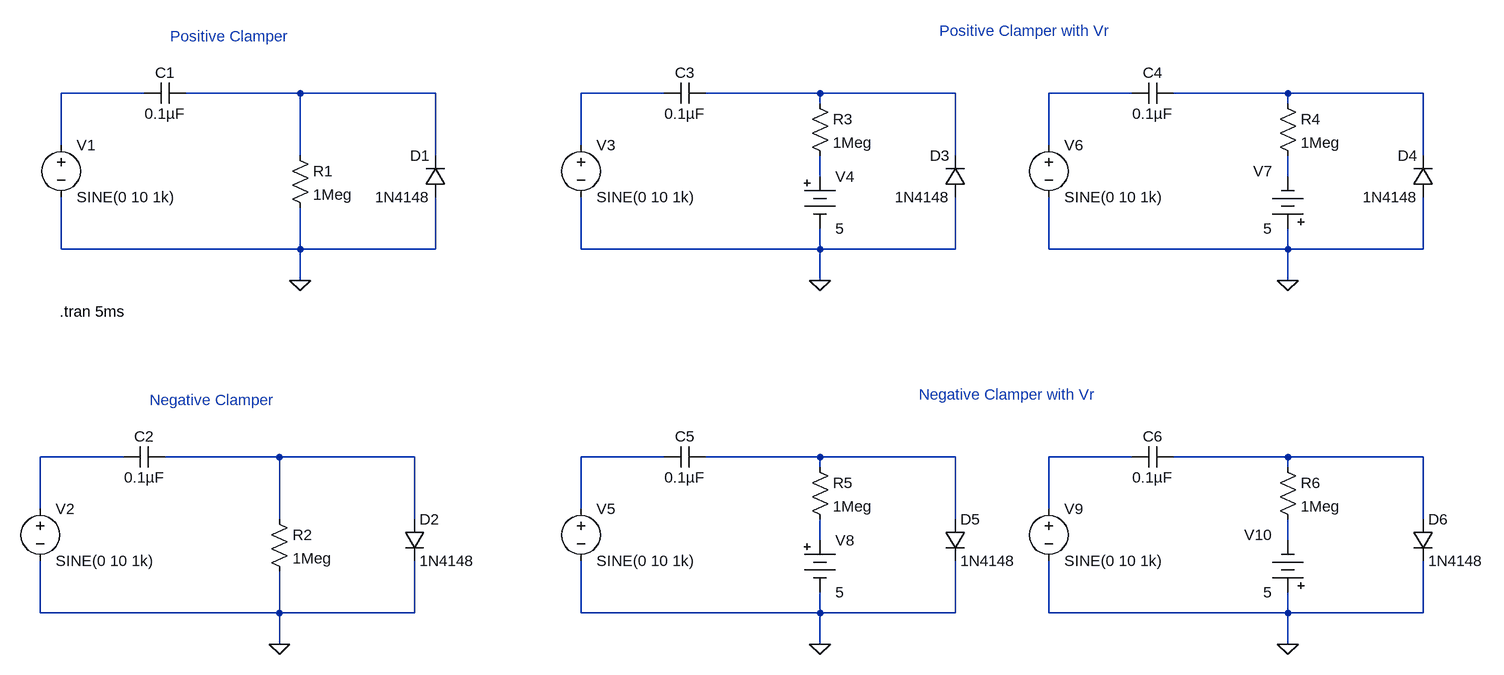
[diagram p0: schematic Diode Clampers.asc]
Diode Clampers.asc, the LTspice schematic file:
Version 4
SHEET 1 2264 952
WIRE 192 64 64 64
WIRE 432 64 256 64
WIRE 640 64 432 64
WIRE 992 64 864 64
WIRE 1232 64 1056 64
WIRE 1440 64 1232 64
WIRE 1712 64 1584 64
WIRE 1952 64 1776 64
WIRE 2160 64 1952 64
WIRE 1232 80 1232 64
WIRE 1952 80 1952 64
WIRE 64 144 64 64
WIRE 864 144 864 64
WIRE 1584 144 1584 64
WIRE 432 160 432 64
WIRE 640 160 640 64
WIRE 1440 160 1440 64
WIRE 2160 160 2160 64
WIRE 1232 192 1232 160
WIRE 1952 192 1952 160
WIRE 64 304 64 224
WIRE 432 304 432 240
WIRE 432 304 64 304
WIRE 640 304 640 224
WIRE 640 304 432 304
WIRE 864 304 864 224
WIRE 1232 304 1232 272
WIRE 1232 304 864 304
WIRE 1440 304 1440 224
WIRE 1440 304 1232 304
WIRE 1584 304 1584 224
WIRE 1952 304 1952 272
WIRE 1952 304 1584 304
WIRE 2160 304 2160 224
WIRE 2160 304 1952 304
WIRE 432 352 432 304
WIRE 1232 352 1232 304
WIRE 1952 352 1952 304
WIRE 160 624 32 624
WIRE 400 624 224 624
WIRE 608 624 400 624
WIRE 992 624 864 624
WIRE 1232 624 1056 624
WIRE 1440 624 1232 624
WIRE 1712 624 1584 624
WIRE 1952 624 1776 624
WIRE 2160 624 1952 624
WIRE 1232 640 1232 624
WIRE 1952 640 1952 624
WIRE 32 704 32 624
WIRE 864 704 864 624
WIRE 1584 704 1584 624
WIRE 400 720 400 624
WIRE 608 720 608 624
WIRE 1440 720 1440 624
WIRE 2160 720 2160 624
WIRE 1232 752 1232 720
WIRE 1952 752 1952 720
WIRE 32 864 32 784
WIRE 400 864 400 800
WIRE 400 864 32 864
WIRE 608 864 608 784
WIRE 608 864 400 864
WIRE 864 864 864 784
WIRE 1232 864 1232 832
WIRE 1232 864 864 864
WIRE 1440 864 1440 784
WIRE 1440 864 1232 864
WIRE 1584 864 1584 784
WIRE 1952 864 1952 832
WIRE 1952 864 1584 864
WIRE 2160 864 2160 784
WIRE 2160 864 1952 864
WIRE 400 912 400 864
WIRE 1232 912 1232 864
WIRE 1952 912 1952 864
FLAG 432 352 0
FLAG 400 912 0
FLAG 1232 352 0
FLAG 1952 352 0
FLAG 1232 912 0
FLAG 1952 912 0
SYMBOL voltage 64 128 R0
WINDOW 123 0 0 Left 2
WINDOW 39 0 0 Left 2
SYMATTR InstName V1
SYMATTR Value SINE(0 10 1k)
SYMBOL cap 256 48 R90
WINDOW 0 0 32 VBottom 2
WINDOW 3 32 32 VTop 2
SYMATTR InstName C1
SYMATTR Value 0.1µF
SYMBOL diode 656 224 R180
WINDOW 0 24 64 Left 2
WINDOW 3 24 0 Left 2
SYMATTR InstName D1
SYMATTR Value 1N4148
SYMBOL res 416 144 R0
SYMATTR InstName R1
SYMATTR Value 1Meg
SYMBOL voltage 32 688 R0
WINDOW 123 0 0 Left 2
WINDOW 39 0 0 Left 2
SYMATTR InstName V2
SYMATTR Value SINE(0 10 1k)
SYMBOL cap 224 608 R90
WINDOW 0 0 32 VBottom 2
WINDOW 3 32 32 VTop 2
SYMATTR InstName C2
SYMATTR Value 0.1µF
SYMBOL diode 592 720 R0
SYMATTR InstName D2
SYMATTR Value 1N4148
SYMBOL res 384 704 R0
SYMATTR InstName R2
SYMATTR Value 1Meg
SYMBOL voltage 864 128 R0
WINDOW 123 0 0 Left 2
WINDOW 39 0 0 Left 2
SYMATTR InstName V3
SYMATTR Value SINE(0 10 1k)
SYMBOL cap 1056 48 R90
WINDOW 0 0 32 VBottom 2
WINDOW 3 32 32 VTop 2
SYMATTR InstName C3
SYMATTR Value 0.1µF
SYMBOL diode 1456 224 R180
WINDOW 0 24 64 Left 2
WINDOW 3 24 0 Left 2
SYMATTR InstName D3
SYMATTR Value 1N4148
SYMBOL res 1216 64 R0
SYMATTR InstName R3
SYMATTR Value 1Meg
SYMBOL Misc\\battery 1232 176 R0
SYMATTR InstName V4
SYMATTR Value 5
SYMBOL voltage 1584 128 R0
WINDOW 123 0 0 Left 2
WINDOW 39 0 0 Left 2
SYMATTR InstName V6
SYMATTR Value SINE(0 10 1k)
SYMBOL cap 1776 48 R90
WINDOW 0 0 32 VBottom 2
WINDOW 3 32 32 VTop 2
SYMATTR InstName C4
SYMATTR Value 0.1µF
SYMBOL diode 2176 224 R180
WINDOW 0 24 64 Left 2
WINDOW 3 24 0 Left 2
SYMATTR InstName D4
SYMATTR Value 1N4148
SYMBOL res 1936 64 R0
SYMATTR InstName R4
SYMATTR Value 1Meg
SYMBOL Misc\\battery 1952 288 R180
WINDOW 0 24 104 Left 2
WINDOW 3 24 16 Left 2
SYMATTR InstName V7
SYMATTR Value 5
SYMBOL voltage 864 688 R0
WINDOW 123 0 0 Left 2
WINDOW 39 0 0 Left 2
SYMATTR InstName V5
SYMATTR Value SINE(0 10 1k)
SYMBOL cap 1056 608 R90
WINDOW 0 0 32 VBottom 2
WINDOW 3 32 32 VTop 2
SYMATTR InstName C5
SYMATTR Value 0.1µF
SYMBOL diode 1424 720 R0
SYMATTR InstName D5
SYMATTR Value 1N4148
SYMBOL res 1216 624 R0
SYMATTR InstName R5
SYMATTR Value 1Meg
SYMBOL Misc\\battery 1232 736 R0
SYMATTR InstName V8
SYMATTR Value 5
SYMBOL voltage 1584 688 R0
WINDOW 123 0 0 Left 2
WINDOW 39 0 0 Left 2
SYMATTR InstName V9
SYMATTR Value SINE(0 10 1k)
SYMBOL cap 1776 608 R90
WINDOW 0 0 32 VBottom 2
WINDOW 3 32 32 VTop 2
SYMATTR InstName C6
SYMATTR Value 0.1µF
SYMBOL diode 2144 720 R0
SYMATTR InstName D6
SYMATTR Value 1N4148
SYMBOL res 1936 624 R0
SYMATTR InstName R6
SYMATTR Value 1Meg
SYMBOL Misc\\battery 1952 848 R180
WINDOW 0 24 104 Left 2
WINDOW 3 24 16 Left 2
SYMATTR InstName V10
SYMATTR Value 5
TEXT 232 -24 Left 2 ;Positive Clamper
TEXT 62 400 Left 2 !.tran 5ms
TEXT 200 536 Left 2 ;Negative Clamper
TEXT 1416 -32 Left 2 ;Positive Clamper with Vr
TEXT 1384 528 Left 2 ;Negative Clamper with Vr

The netlist it stands for:
* Diode Clampers.asc
V1 N001 0 SINE(0 10 1k)
C1 N002 N001 0.1µF
D1 0 N002 1N4148
R1 N002 0 1Meg
V2 N009 0 SINE(0 10 1k)
C2 N010 N009 0.1µF
D2 N010 0 1N4148
R2 N010 0 1Meg
V3 N003 0 SINE(0 10 1k)
C3 N004 N003 0.1µF
D3 0 N004 1N4148
R3 N004 N007 1Meg
V4 N007 0 5
V6 N005 0 SINE(0 10 1k)
C4 N006 N005 0.1µF
D4 0 N006 1N4148
R4 N006 N008 1Meg
V7 0 N008 5
V5 N011 0 SINE(0 10 1k)
C5 N012 N011 0.1µF
D5 N012 0 1N4148
R5 N012 N015 1Meg
V8 N015 0 5
V9 N013 0 SINE(0 10 1k)
C6 N014 N013 0.1µF
D6 N014 0 1N4148
R6 N014 N016 1Meg
V10 0 N016 5
.model D D
.lib standard.dio
* Positive Clamper
.tran 5ms
* Negative Clamper
* Positive Clamper with Vr
* Negative Clamper with Vr
.backanno
.end